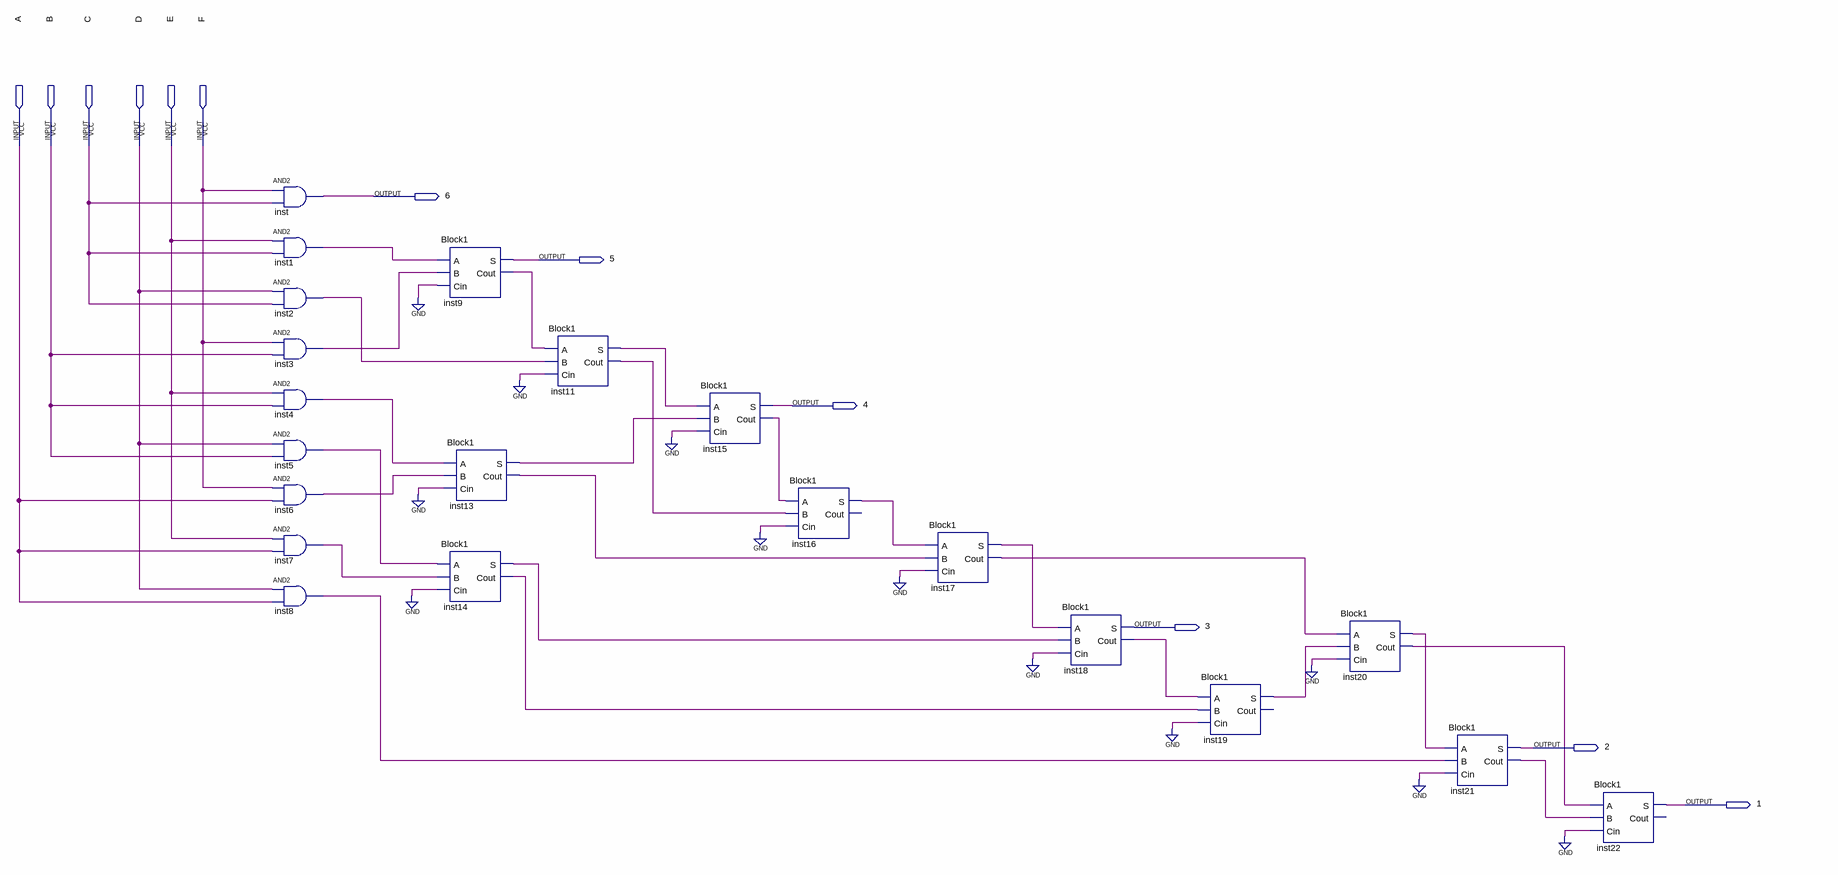
[diagram p0: schematic sheet]
// Quartus schematic multiplicador.bdf as structural Verilog: 21 symbols, 12 pins
module multiplicador (
  input  A,
  input  B,
  input  C,
  input  D,
  input  E,
  input  F,
  output \6 ,
  output \5 ,
  output \4 ,
  output \3 ,
  output \2 ,
  output \1 
);

  wire inst1_out, inst2_out, inst3_out, inst4_out, inst5_out, inst6_out, inst7_out, inst8_out, inst9_cout,
       inst11_cout, inst11_s, inst13_cout, inst13_s, inst14_cout, inst14_s, inst15_cout, inst16_s,
       inst17_cout, inst17_s, inst18_cout, inst19_s, inst20_cout, inst20_s, inst21_cout;

  and inst (\6 , F, C);
  and inst1 (inst1_out, E, C);
  and inst2 (inst2_out, D, C);
  and inst3 (inst3_out, F, B);
  and inst4 (inst4_out, E, B);
  and inst5 (inst5_out, D, B);
  and inst6 (inst6_out, F, A);
  and inst7 (inst7_out, E, A);
  and inst8 (inst8_out, D, A);
  Block1 inst9 (.A(inst1_out), .B(inst3_out), .Cin(1'b0), .S(\5 ), .Cout(inst9_cout));
  Block1 inst13 (.A(inst4_out), .B(inst6_out), .Cin(1'b0), .S(inst13_s), .Cout(inst13_cout));
  Block1 inst14 (.A(inst5_out), .B(inst7_out), .Cin(1'b0), .S(inst14_s), .Cout(inst14_cout));
  Block1 inst11 (.A(inst9_cout), .B(inst2_out), .Cin(1'b0), .S(inst11_s), .Cout(inst11_cout));
  Block1 inst15 (.A(inst11_s), .B(inst13_s), .Cin(1'b0), .S(\4 ), .Cout(inst15_cout));
  Block1 inst16 (.A(inst15_cout), .B(inst11_cout), .Cin(1'b0), .S(inst16_s));  // open: Cout
  Block1 inst17 (.A(inst16_s), .B(inst13_cout), .Cin(1'b0), .S(inst17_s), .Cout(inst17_cout));
  Block1 inst18 (.A(inst17_s), .B(inst14_s), .Cin(1'b0), .S(\3 ), .Cout(inst18_cout));
  Block1 inst19 (.A(inst18_cout), .B(inst14_cout), .Cin(1'b0), .S(inst19_s));  // open: Cout
  Block1 inst20 (.A(inst17_cout), .B(inst19_s), .Cin(1'b0), .S(inst20_s), .Cout(inst20_cout));
  Block1 inst21 (.A(inst20_s), .B(inst8_out), .Cin(1'b0), .S(\2 ), .Cout(inst21_cout));
  Block1 inst22 (.A(inst20_cout), .B(inst21_cout), .Cin(1'b0), .S(\1 ));  // open: Cout
endmodule
